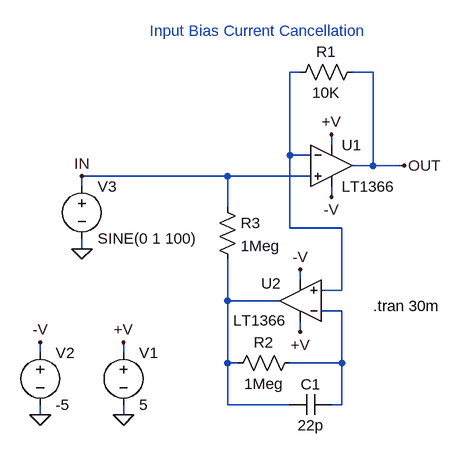
[diagram p0: schematic 1366.asc]
1366.asc, the LTspice schematic file:
Version 4
SHEET 1 896 720
WIRE 208 -32 192 -32
WIRE 320 -32 288 -32
WIRE 256 80 256 64
WIRE 192 96 192 -32
WIRE 224 96 192 96
WIRE 320 112 320 -32
WIRE 320 112 288 112
WIRE 368 112 320 112
WIRE 96 128 -128 128
WIRE 224 128 96 128
WIRE -128 144 -128 128
WIRE 256 160 256 144
WIRE 96 176 96 128
WIRE 192 208 192 96
WIRE 272 208 192 208
WIRE -128 240 -128 224
WIRE 208 288 208 272
WIRE 272 304 272 208
WIRE 272 304 240 304
WIRE 96 320 96 256
WIRE 176 320 96 320
WIRE 272 336 240 336
WIRE 208 368 208 352
WIRE -192 400 -192 384
WIRE -64 400 -64 384
WIRE 96 416 96 320
WIRE 112 416 96 416
WIRE 272 416 272 336
WIRE 272 416 192 416
WIRE 96 480 96 416
WIRE 192 480 96 480
WIRE 272 480 272 416
WIRE 272 480 256 480
WIRE -192 496 -192 480
WIRE -64 496 -64 480
FLAG -64 496 0
FLAG 256 64 +V
FLAG -64 384 +V
FLAG 256 160 -V
FLAG -192 496 0
FLAG -192 384 -V
FLAG 208 368 +V
FLAG 208 272 -V
FLAG 368 112 OUT
FLAG -128 128 IN
FLAG -128 240 0
SYMBOL voltage -64 384 R0
SYMATTR InstName V1
SYMATTR Value 5
SYMBOL voltage -192 384 R0
SYMATTR InstName V2
SYMATTR Value -5
SYMBOL res 304 -48 R90
WINDOW 0 0 56 VBottom 2
WINDOW 3 32 56 VTop 2
SYMATTR InstName R1
SYMATTR Value 10K
SYMBOL opamps\\LT1366 256 48 R0
SYMATTR InstName U1
SYMBOL opamps\\LT1366 208 384 R180
WINDOW 0 29 91 Left 2
WINDOW 3 21 34 Left 2
SYMATTR InstName U2
SYMBOL res 208 400 R90
WINDOW 0 0 56 VBottom 2
WINDOW 3 32 56 VTop 2
SYMATTR InstName R2
SYMATTR Value 1Meg
SYMBOL cap 256 464 R90
WINDOW 0 0 32 VBottom 2
WINDOW 3 32 32 VTop 2
SYMATTR InstName C1
SYMATTR Value 22p
SYMBOL res 80 160 R0
SYMATTR InstName R3
SYMATTR Value 1Meg
SYMBOL voltage -128 128 R0
SYMATTR InstName V3
SYMATTR Value SINE(0 1 100)
TEXT 320 328 Left 2 !.tran 30m
TEXT 144 -80 Bottom 2 ;Input Bias Current Cancellation

The netlist it stands for:
* 1366.asc
V1 +V 0 5
V2 -V 0 -5
R1 OUT N001 10K
XU1 IN N001 +V -V OUT LT1366  ; pins In+ In- V+ V- OUT
XU2 N001 N003 +V -V N002 LT1366  ; pins In+ In- V+ V- OUT
R2 N003 N002 1Meg
C1 N003 N002 22p
R3 IN N002 1Meg
V3 IN 0 SINE(0 1 100)
.tran 30m
* Input Bias Current Cancellation
.lib LTC.lib
.backanno
.end